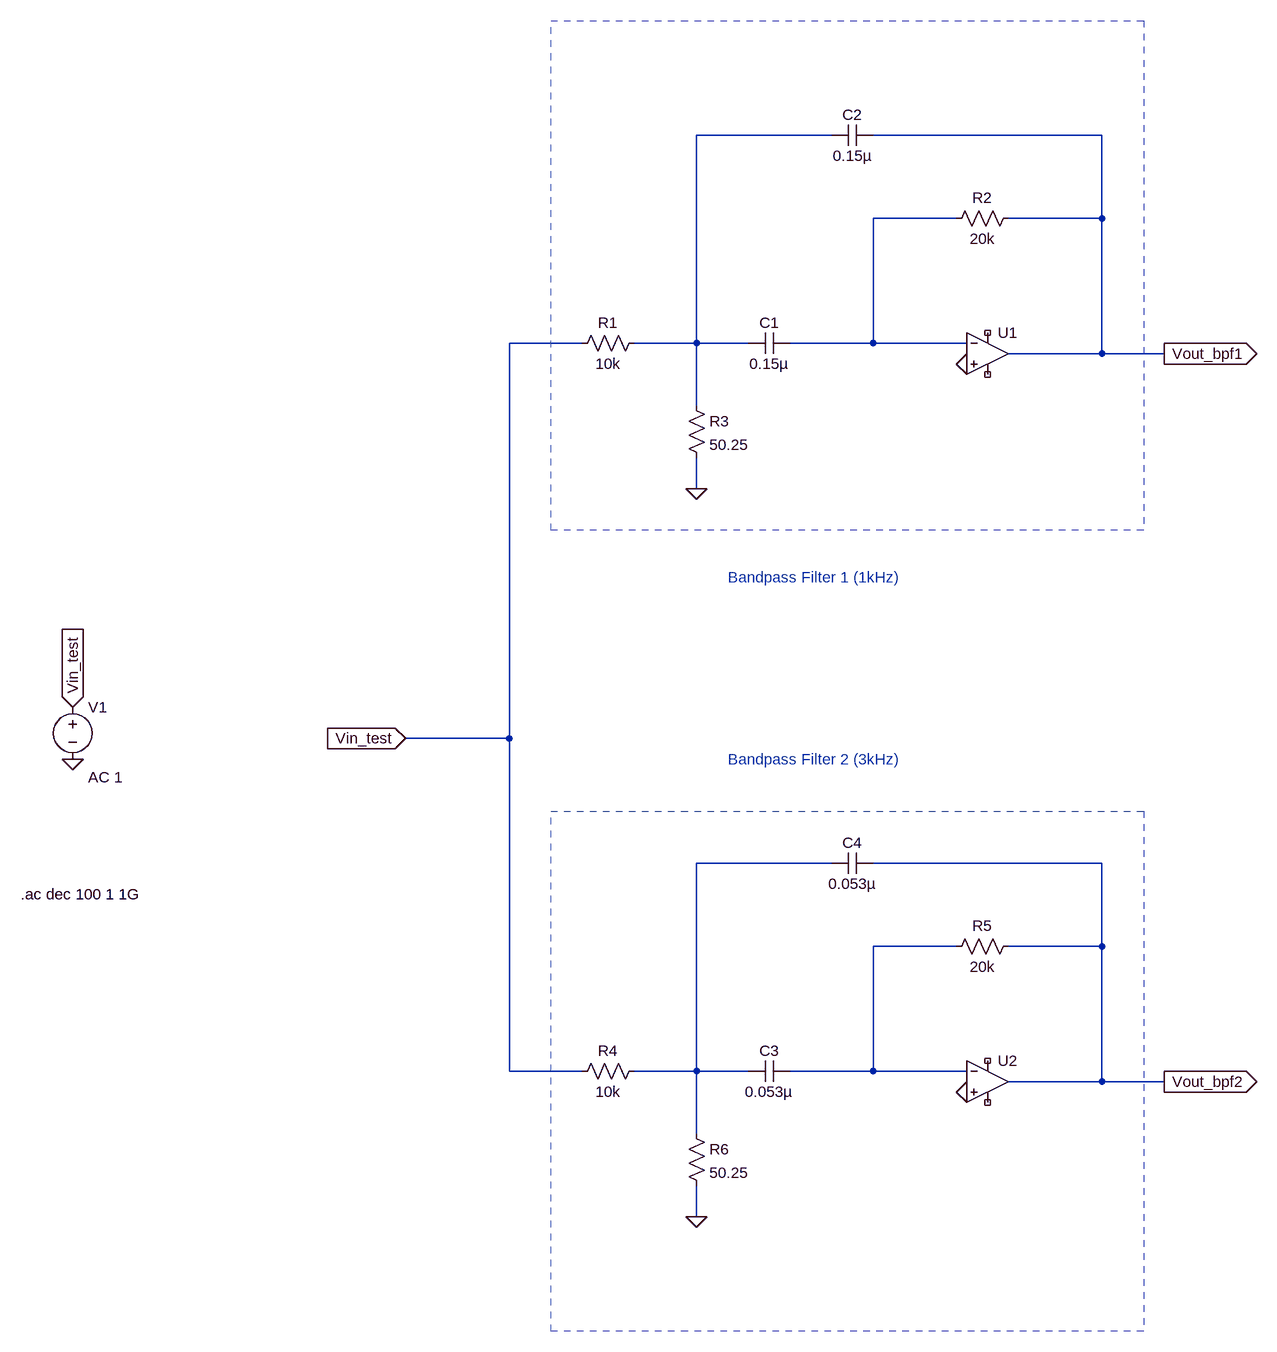
[diagram p0: schematic Ex 6 Bode.asc]
Ex 6 Bode.asc, the LTspice schematic file:
Version 4
SHEET 1 2004 1428
WIRE 720 -624 512 -624
WIRE 1136 -624 784 -624
WIRE 912 -496 784 -496
WIRE 1136 -496 1136 -624
WIRE 1136 -496 992 -496
WIRE 336 -304 224 -304
WIRE 512 -304 512 -624
WIRE 512 -304 416 -304
WIRE 592 -304 512 -304
WIRE 784 -304 784 -496
WIRE 784 -304 656 -304
WIRE 928 -304 784 -304
WIRE 1136 -288 1136 -496
WIRE 1136 -288 992 -288
WIRE 1232 -288 1136 -288
WIRE 512 -208 512 -304
WIRE 512 -80 512 -128
WIRE 224 304 224 -304
WIRE 224 304 64 304
WIRE 720 496 512 496
WIRE 1136 496 784 496
WIRE 912 624 784 624
WIRE 1136 624 1136 496
WIRE 1136 624 992 624
WIRE 224 816 224 304
WIRE 336 816 224 816
WIRE 512 816 512 496
WIRE 512 816 416 816
WIRE 592 816 512 816
WIRE 784 816 784 624
WIRE 784 816 656 816
WIRE 928 816 784 816
WIRE 1136 832 1136 624
WIRE 1136 832 992 832
WIRE 1232 832 1136 832
WIRE 512 912 512 816
WIRE 512 1040 512 992
FLAG 1232 -288 Vout_bpf1
IOPIN 1232 -288 Out
FLAG 512 -80 0
FLAG 1232 832 Vout_bpf2
IOPIN 1232 832 Out
FLAG 512 1040 0
FLAG 64 304 Vin_test
IOPIN 64 304 In
FLAG -448 336 0
FLAG -448 256 Vin_test
IOPIN -448 256 In
FLAG 928 -272 0
FLAG 928 848 0
SYMBOL res 432 -320 R90
WINDOW 0 0 56 VBottom 2
WINDOW 3 32 56 VTop 2
SYMATTR InstName R1
SYMATTR Value 10k
SYMBOL cap 656 -320 R90
WINDOW 0 0 32 VBottom 2
WINDOW 3 32 32 VTop 2
SYMATTR InstName C1
SYMATTR Value 0.15µ
SYMBOL res 1008 -512 R90
WINDOW 0 0 56 VBottom 2
WINDOW 3 32 56 VTop 2
SYMATTR InstName R2
SYMATTR Value 20k
SYMBOL res 496 -224 R0
SYMATTR InstName R3
SYMATTR Value 50.25
SYMBOL cap 784 -640 R90
WINDOW 0 0 32 VBottom 2
WINDOW 3 32 32 VTop 2
SYMATTR InstName C2
SYMATTR Value 0.15µ
SYMBOL res 432 800 R90
WINDOW 0 0 56 VBottom 2
WINDOW 3 32 56 VTop 2
SYMATTR InstName R4
SYMATTR Value 10k
SYMBOL cap 656 800 R90
WINDOW 0 0 32 VBottom 2
WINDOW 3 32 32 VTop 2
SYMATTR InstName C3
SYMATTR Value 0.053µ
SYMBOL res 1008 608 R90
WINDOW 0 0 56 VBottom 2
WINDOW 3 32 56 VTop 2
SYMATTR InstName R5
SYMATTR Value 20k
SYMBOL res 496 896 R0
SYMATTR InstName R6
SYMATTR Value 50.25
SYMBOL cap 784 480 R90
WINDOW 0 0 32 VBottom 2
WINDOW 3 32 32 VTop 2
SYMATTR InstName C4
SYMATTR Value 0.053µ
SYMBOL voltage -448 240 R0
WINDOW 123 24 124 Left 2
WINDOW 39 0 0 Left 0
SYMATTR Value2 AC 1
SYMATTR InstName V1
SYMATTR Value ""
SYMBOL OpAmps\\UniversalOpAmp 960 -288 R0
SYMATTR InstName U1
SYMBOL OpAmps\\UniversalOpAmp 960 832 R0
SYMATTR InstName U2
TEXT 560 56 Left 2 ;Bandpass Filter 1 (1kHz)
TEXT 560 336 Left 2 ;Bandpass Filter 2 (3kHz)
TEXT -528 544 Left 2 !.ac dec 100 1 1G
RECTANGLE Normal 1200 -16 288 -800 2
RECTANGLE Normal 1200 1216 288 416 2

The netlist it stands for:
* Ex 6 Bode.asc
R1 N001 Vin_test 10k
C1 N002 N001 0.15µ
R2 Vout_bpf1 N002 20k
R3 N001 0 50.25
C2 Vout_bpf1 N001 0.15µ
R4 N003 Vin_test 10k
C3 N004 N003 0.053µ
R5 Vout_bpf2 N004 20k
R6 N003 0 50.25
C4 Vout_bpf2 N003 0.053µ
V1 Vin_test 0 AC 1
XU1 0 N002 NC_01 NC_02 Vout_bpf1 level1 Avol=1Meg GBW=10Meg Vos=0 En=0 Enk=0 In=0 Ink=0 Rin=500Meg  ; pins In+ In- V+ V- OUT
XU2 0 N004 NC_03 NC_04 Vout_bpf2 level1 Avol=1Meg GBW=10Meg Vos=0 En=0 Enk=0 In=0 Ink=0 Rin=500Meg  ; pins In+ In- V+ V- OUT
* Bandpass Filter 1 (1kHz)
* Bandpass Filter 2 (3kHz)
.ac dec 100 1 1G
.lib UniversalOpAmp1.lib
.backanno
.end